# Altium schematic sheet 5VRegulator.SchDoc: 5V Regulator
size A4; Author: Miłosz Werner & Julia Rzepka; DrawnBy: Miłosz Werner; Organization: Wroclaw University of Science and Technology; Revision: 1.0; SheetNumber: 7; SheetTotal: 9
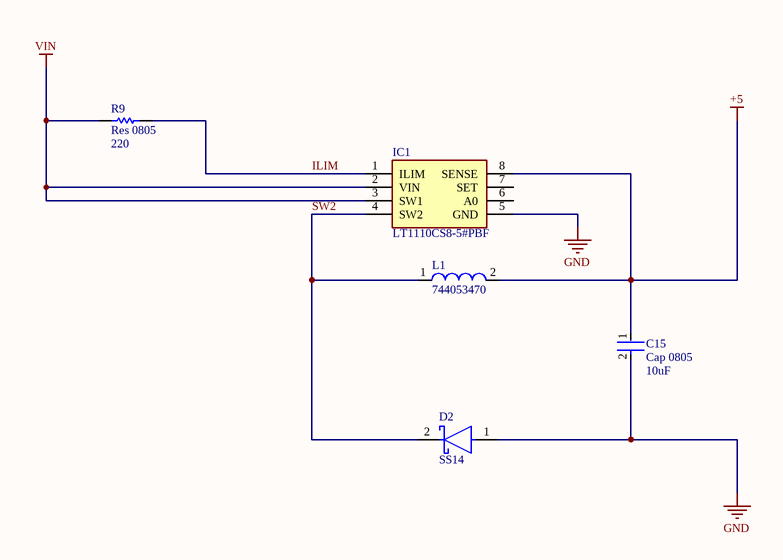
[diagram p0: 5VRegulator.SchDoc]

## Parts
C15  Cap 0805  value 10uF  [FP-GRM216-0_1-IPC_C]
D2  SS14  [FP-403AE-MFG]
IC1  LT1110CS8-5#PBF  [SOIC127P599X175-8N]
L1  744053470  [WE-TPC-5828-LH]
R9  Res 0805  value 220  [RESC2013X50X30LL20T20]

## Nets
+5: C15.1 IC1.8(SENSE) L1.2
GND: C15.2 D2.1(A) IC1.5(GND)
VIN: IC1.2(VIN) IC1.3(SW1) R9.2
ILIM: IC1.1(ILIM) R9.1
SW2: D2.2(C) IC1.4(SW2) L1.1

Not connected (* = marked no-connect by the designer): IC1 6(A0) 7(SET)

## Library data of the parts
C15 = CMP-2007-00889-2: Capacitor; Capacitance: 100nF; Mount: Surface Mount; Case/Package: 0805; Case Code (Imperial): 0805
D2 = CMP-2000-04943-2: DIODE SCHOTTKY 40V 1A SMA; Manufacturer: ON Semiconductor; Peak Reverse Current: 0.2mA; Max Junction Temp: +125°C; Standoff Height: 0.05mm; Max Surge Forward Current: 40A; Mouser Description: Schottky Diodes & Rectifiers SMA 40V 1.0A; RoHS: TRUE; Lead Free: Yes; Manufacturer Part Number: SS14; Device Class L3: Schottky Diodes; Category: Diode; Automotive: No; Digikey Description: DIODE SCHOTTKY 40V 1A SMA; ComponentLink2Description: Datasheet; Device Class L2: Diodes; Height: 2.5mm; Temperature Range High: +125°C; ComponentLink2URL: https://www.onsemi.com/pub/Collateral/SS19-D.PDF; Device Class L1: Discrete Semiconductors; Package: 403AE; Octopart: https://octopart.com/ss14-on+semiconductor-29205033; Max Repetitive Reverse Voltage: 40V; Temperature Range Low: -65°C; Forward Current: 1A; Temperature: -65°C to +125°C
IC1 = LT1110CS8#PBF: Conv DC-DC 1V to 30V Non-Inv/Inv/Step Up/Step Down Single-Out 5V Micropower 8-Pin SOIC N Tube; Manufacturer_Name: Linear Technology; Datasheet Link: https://www.analog.com/media/en/technical-documentation/data-sheets/lt1110.pdf; Height: 1.752mm; Manufacturer_Part_Number: LT1110CS8-5#PBF; Mouser Part Number: 584-LT1110CS8-5#PBF; Mouser Price/Stock: https://www.mouser.com/Search/Refine.aspx?Keyword=584-LT1110CS8%23PBF; Supplier 1: Mouser; Supplier Part Number 1: 584-LT1110CS8#PBF
L1 = CMP-0227-00413-1: SMD Shielded Tiny Power Inductor WE-TPC, L = 47.0 µH; Inductance: 47.0 ÂµH; PackageVersion: 2010; ComponentLink2Description: Datasheet; ComponentLink2URL: http://www.we-online.de/katalog/media/pdf/744053470.pdf; ComponentLink1Description: Manufacturer Link; PackageDescription: SMD Inductor, 2-Leads, Body 5.8 x 5.8 mm; DatasheetVersion: ver 6, Aug-2010; ComponentLink1URL: http://www.we-online.com; PackageReference: WE-TPC-5828-LH
R9 = CMP-2001-03735-1: Resistor